# Altium project PCB_ProjectTP1.PrjPCB
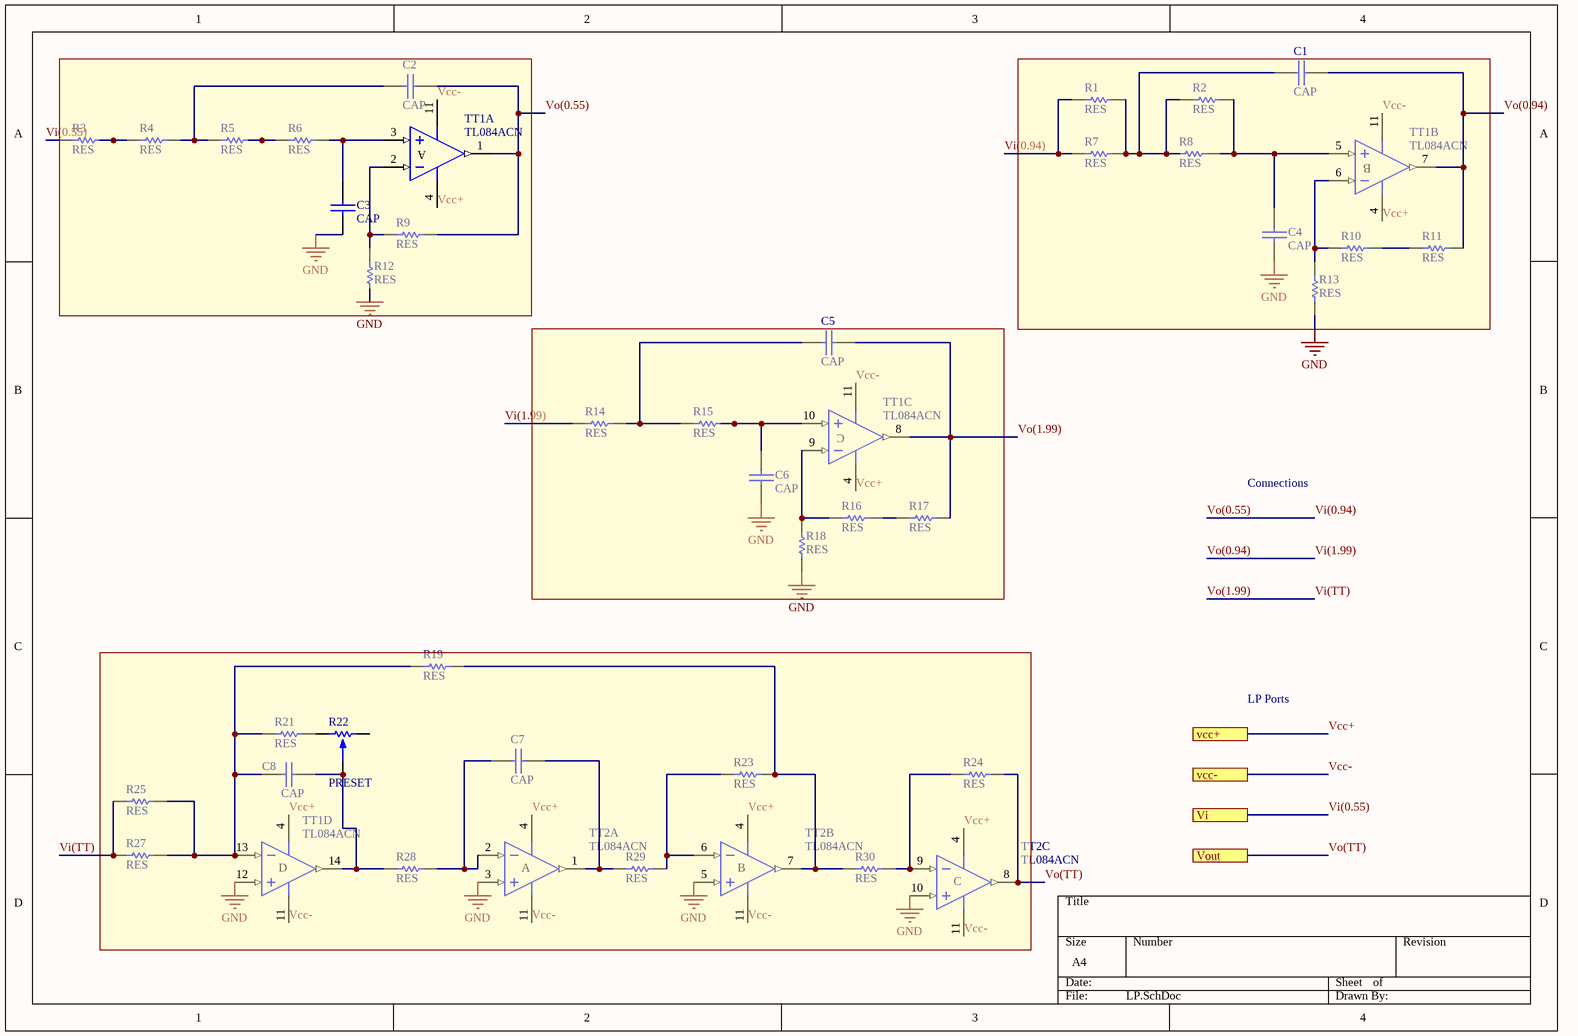
[diagram p0: LP.SchDoc]
1 sheet, 38 parts. Net scope: flat (ports and power ports of the same name join across sheets).
Board file: ASSD_TP1.PcbDoc

## Sheet LP.SchDoc
size A4

### Parts
C1  CAP  [0805]
C2  CAP  [0805]
C3  CAP  [0805]
C4  CAP  [0805]
C5  CAP  [0805]
C6  CAP  [0805]
C7  CAP  [0805]
C8  CAP  [0805]
R1  RES  [0805]
R2  RES  [0805]
R3  RES  [0805]
R4  RES  [0805]
R5  RES  [0805]
R6  RES  [0805]
R7  RES  [0805]
R8  RES  [0805]
R9  RES  [0805]
R10  RES  [0805]
R11  RES  [0805]
R12  RES  [0805]
R13  RES  [0805]
R14  RES  [0805]
R15  RES  [0805]
R16  RES  [0805]
R17  RES  [0805]
R18  RES  [0805]
R19  RES  [0805]
R21  RES  [0805]
R22  PRESET  [PRESET V]
R23  RES  [0805]
R24  RES  [0805]
R25  RES  [0805]
R27  RES  [0805]
R28  RES  [0805]
R29  RES  [0805]
R30  RES  [0805]
TT1  TL084ACN  [DIP14]  (parts A,B,C,D of 4)
TT2  TL084ACN  [DIP14]  (parts A,B,C of 4)

### Ports
vcc+, vcc-, Vi, Vout

### Nets
GND: C3.1 C4.1 C6.1 R12.1 R13.1 R18.1 TT1.12(IN+) TT2.3(IN+) TT2.5(IN+) TT2.10(IN+)
Vcc+: TT1.4(V+) TT2.4(V+) ; port vcc+
Vcc-: TT1.11(V-) TT2.11(V-) ; port vcc-
Vi(0.55): R3.1 ; port Vi
Vi(0.94): C2.2 R1.1 R7.1 R9.1 TT1.1(OUT)  [also labelled Vo(0.55)]
Vi(1.99): C1.2 R11.2 R14.1 TT1.7(OUT)  [also labelled Vo(0.94)]
Vi(TT): C5.2 R17.1 R25.1 R27.1 TT1.8(OUT)  [also labelled Vo(1.99)]
Vo(TT): R24.2 TT2.8(OUT) ; port Vout
NetC1_1: C1.1 R1.2 R2.1 R7.2 R8.1
NetC2_1: C2.1 R4.2 R5.1
NetC3_2: C3.2 R6.2 TT1.3(IN+)
NetC4_2: C4.2 R2.2 R8.2 TT1.5(IN+)
NetC5_1: C5.1 R14.2 R15.1
NetC6_2: C6.2 R15.2 TT1.10(IN+)
NetC7_1: C7.1 R28.2 TT2.2(IN-)
NetC7_2: C7.2 R29.1 TT2.1(OUT)
NetC8_1: C8.1 R19.1 R21.1 R25.2 R27.2 TT1.13(IN-)
NetC8_2: C8.2 R22.2 R28.1 TT1.14(OUT)
NetR3_2: R3.2 R4.1
NetR5_2: R5.2 R6.1
NetR9_2: R9.2 R12.2 TT1.2(IN-)
NetR10_1: R10.1 R11.1
NetR10_2: R10.2 R13.2 TT1.6(IN-)
NetR16_1: R16.1 R17.2
NetR16_2: R16.2 R18.2 TT1.9(IN-)
NetR19_2: R19.2 R23.2 R30.1 TT2.7(OUT)
NetR21_2: R21.2 R22.3
NetR23_1: R23.1 R29.2 TT2.6(IN-)
NetR24_1: R24.1 R30.2 TT2.9(IN-)

Not connected (* = marked no-connect by the designer): R22 1

### Notes on the sheet
- Connections
- LP Ports
- (in symbol TL084ACN, part A) A
- (in symbol TL084ACN, part B) B
- (in symbol TL084ACN, part C) C
- (in symbol TL084ACN, part D) D

### Library data of the parts
TT1 TT2 = TL084ACN: General-Purpose J-FET Quad Operational Amplifier; Published: 24-Aug-2001; LatestRevisionDate: 06-Jun-2005; LatestRevisionNote: Stylized 3D Model Added.; DatasheetVersion: Jan-1999; PackageVersion: Jan-1997; PackageReference: DIP14; Publisher: Altium Limited; PackageDescription: DIP; 14 Leads; Row Spacing 7.62 mm; Pitch 2.54 mm; ComponentLink1Description: Manufacturer Link; ComponentLink1URL: http://www.st.com/; ComponentLink2Description: Datasheet; ComponentLink2URL: http://www.st.com/stonline/products/literature/ds/2301/tl084.pdf